# EAGLE design BBPS_SMD (EAGLE 6.2)
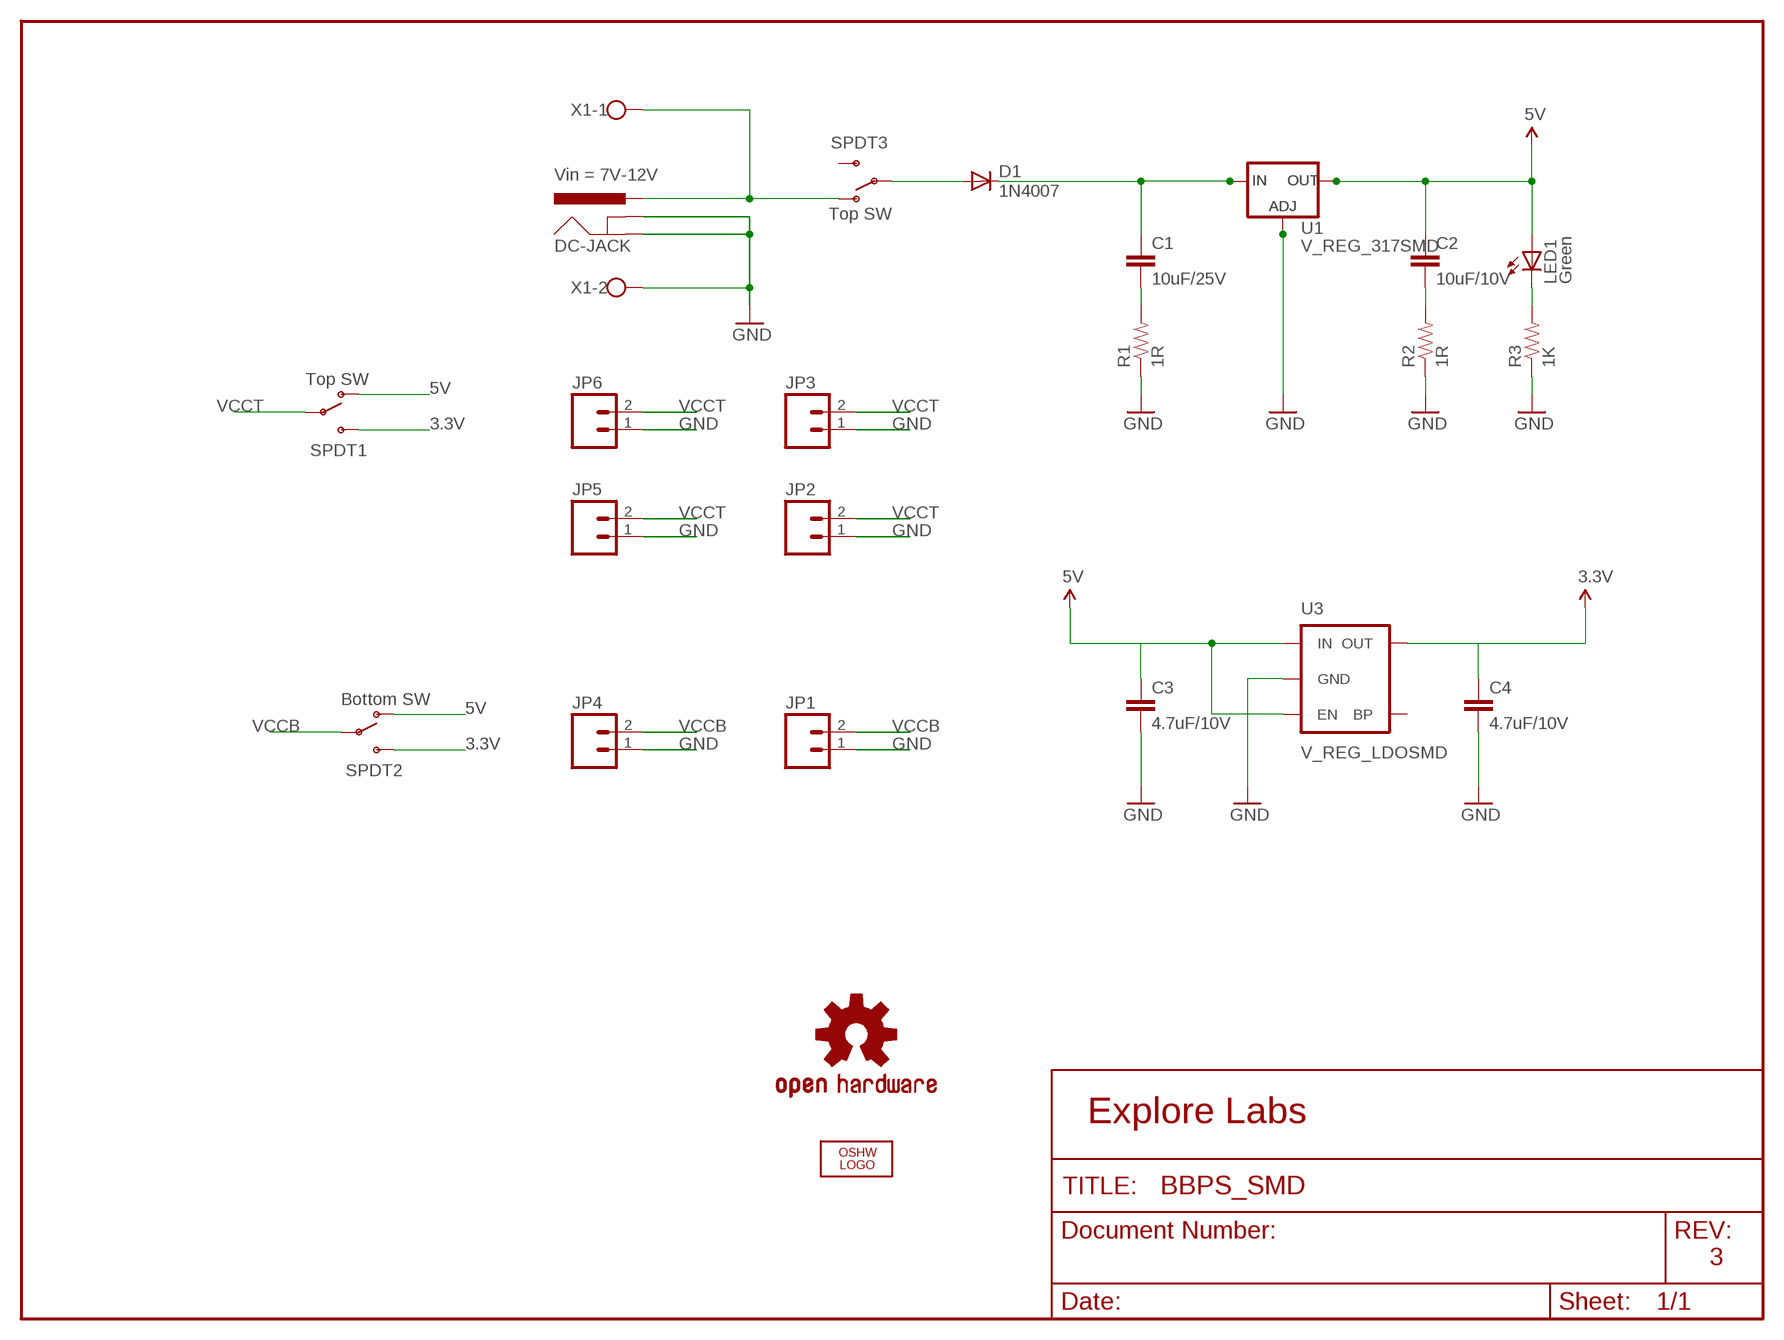
[diagram p0: schematic, sheet 1]

## Parts
C1  10uF/25V  CAP0603-CAP  [0603-CAP]
C2  10uF/10V  CAP0603-CAP  [0603-CAP]
C3  4.7uF/10V  CAP0603-CAP  [0603-CAP]
C4  4.7uF/10V  CAP0603-CAP  [0603-CAP]
D1  1N4007  DIODESMA-KIT  [SMA-DIODE-KIT]
DC-JACK  Vin = 7V-12V  POWER_JACKPTH  [POWER_JACK_PTH]
JP1  M02PTH  [1X02]
JP2  M02PTH  [1X02]
JP3  M02PTH  [1X02]
JP4  M02PTH  [1X02]
JP5  M02PTH  [1X02]
JP6  M02PTH  [1X02]
LED1  Green  LEDCHIPLED_0805  [CHIPLED_0805]
LOGO2  OSHW_LOGO_FILLX0100-NT  [OSHW_FILLX100_NOTEXT]
R1  1R  RESISTOR0603-RES  [0603-RES]
R2  1R  RESISTOR0603-RES  [0603-RES]
R3  1K  RESISTOR0603-RES  [0603-RES]
SPDT1  Top SW  SWITCH-SPSTPTH  [SWITCH-SPDT]
SPDT2  Bottom SW  SWITCH-SPSTPTH  [SWITCH-SPDT]
SPDT3  Top SW  SWITCH-SPSTPTH  [SWITCH-SPDT]
U1  V_REG_317SMD  [SOT223]
U2  V_REG_317DPACK  [V-REG_DPACK]
U3  V_REG_LDOSMD  [SOT23-5]
U$3  OSHW-LOGOM  [OSHW-LOGO-M]
X1  W237-102  [W237-102]

## Nets
3.3V: C4.1 SPDT1.3(S) SPDT2.3(S) U3.5(OUT)
5V: C2.1 C3.1 LED1.A SPDT1.1(O) SPDT2.1(O) U1.2(OUT) U2.4(OUT) U3.1(IN) U3.3(EN)
GND: C3.2 C4.2 DC-JACK.GND DC-JACK.GNDBREAK JP1.1 JP2.1 JP3.1 JP4.1 JP5.1 JP6.1 R1.1 R2.1 R3.1 U1.1(ADJ) U2.1(ADJ) U3.2(GND) X1.2
N$2: D1.A SPDT3.2(P)
N$5: DC-JACK.PWR SPDT3.1(O) X1.1
N$6: C1.2 R1.2
N$8: C2.2 R2.2
N$10: LED1.C R3.2
N$13: C1.1 D1.C U1.3(IN) U2.3(IN)
VCCB: JP1.2 JP4.2 SPDT2.2(P)
VCCT: JP2.2 JP3.2 JP5.2 JP6.2 SPDT1.2(P)
Unconnected: SPDT3.3(S) U3.4(BP)

## Notes on the sheet
- Explore Labs
- 3

## Library data of the parts
C1-C4 = SparkFun-Passives:CAP: Capacitor Standard 0603 ceramic capacitor, and 0.1" leaded capacitor.
D1 = SparkFun-DiscreteSemi:DIODE: Diode These are standard reverse protection diodes and small signal diodes. SMA package can handle up to about 1A. SOD-323 can handle about 200mA. What the SOD-323 package when ordering, there are some mfgs out there that are 5-pin packages.
DC-JACK = SparkFun:POWER_JACK: Power Jack This is the standard 5.5mm barrel jack for power. The PTH is the most common, proven, reliable, footprint. All others are experimental. The Slot footprint only works if the mill layer is transmitted to the PCB fab house so be warned. Spark Fun Electronics SKU : PRT-00119. Mating wall wart : TOL-00298 (and others)
JP1-JP6 = SparkFun-Connectors:M02: Header 2 Standard 2-pin 0.1" header. Use with straight break away headers (SKU : PRT-00116), right angle break away headers (PRT-00553), swiss pins (PRT-00743), machine pins (PRT-00117), and female headers (PRT-00115). Molex polarized connector foot print use with SKU : PRT-08233 with associated crimp pins and housings.
LED1 = led:LED: LED OSRAM: - CHIPLED LG R971, LG N971, LY N971, LG Q971, LY Q971, LO R971, LY R971 LH N974, LH R974 LS Q976, LO Q976, LY Q976 LO Q996 - Hyper CHIPLED LW Q18S LB Q993, LB Q99A, LB R99A - SideLED LS A670, LO A670, LY A670, LG A670, LP A670 LB A673, LV A673, LT A673, LW A673 LH A674 LY A675 LS A676, LA A676, LO A676, LY A676, LW A676 LS A679, LY A679, LG A679 - Hyper Micro SIDELED® LS Y876, LA Y876, LO Y876, LY Y876 LT Y87S - SmartLED LW L88C, LW L88S LB L89C, LB L89S, LG L890 LS L89K, LO L89K, LY L89K LS L896, LA L896, LO L896, LY L896 - TOPLED LS T670, LO T670, LY T670, LG T670, LP T670 LSG T670, LSP T670, LSY T670, LOP T670, LYG T670 LG T671, LOG T671, LSG T671 LB T673, LV T673, LT T673, LW T673 LH T674 LS T676, LA T676, LO T676, LY T676, LB T676, LH T676, LSB T676, LW T676 LB T67C, LV T67C, LT T67C, LS T67K, LO T67K, LY T67K, LW E67C LS E67B, LA E67B, LO E67B, LY E67B, LB E67C, LV E67C, LT E67C LW T67C LS T679, LY T679, LG T679 LS T770, LO T770, LY T770, LG T770, LP T770 LB T773, LV T773, LT T773, LW T773 LH T774 LS E675, LA E675, LY E675, LS T675 LS T776, LA T776, LO T776, LY T776, LB T776 LHGB T686 LT T68C, LB T68C - Hyper Mini TOPLED® LB M676 - Mini TOPLED Santana® LG M470 LS M47K, LO M47K, LY M47K Source: http://www.osram.convergy.de LUXEON: - LUMILED® LXK2-PW12-R00, LXK2-PW12-S00, LXK2-PW14-U00, LXK2-PW14-V00 LXK2-PM12-R00, LXK2-PM12-S00, LXK2-PM14-U00 LXK2-PE12-Q00, LXK2-PE12-R00, LXK2-PE12-S00, LXK2-PE14-T00, LXK2-PE14-U00 LXK2-PB12-K00, LXK2-PB12-L00, LXK2-PB12-M00, LXK2-PB14-N00, LXK2-PB14-P00, LXK2-PB14-Q00 LXK2-PR12-L00, LXK2-PR12-M00, LXK2-PR14-Q00, LXK2-PR14-R00 LXK2-PD12-Q00, LXK2-PD12-R00, LXK2-PD12-S00 LXK2-PH12-R00, LXK2-PH12-S00 LXK2-PL12-P00, LXK2-PL12-Q00, LXK2-PL12-R00 Source: www.luxeon.com KINGBRIGHT: KA-3528ASYC Source: www.kingbright.com
LOGO2 = ohw-logo:OSHW_LOGO_FILL
R1-R3 = SparkFun-Passives:RESISTOR: Resistor Basic schematic elements and footprints for 0603, 1206, and PTH resistors.
SPDT1-SPDT3 = SparkFun:SWITCH-SPST: SPST Switch Simple slide switch. Spark Fun Electronics SKU : COM-00102
U1 U2 = SparkFun-PowerIC:V_REG_317: Voltage Regulator Standard LM317 adjustable voltage regulator. AOI (Adjust Output Input). Google 'LM317 Calculator' for easy to use app to get the two resistor values needed. 240/720 for 5V output. 240/390 for 3.3V output. Spark Fun Electronics SKU : COM-00527
U3 = SparkFun-PowerIC:V_REG_LDO: Voltage Regulator LDO Standard 150mA LDO voltage regulator in SOT-23 layout. Micrel part MIC5205. BP (by-pass) pin is used to lower output noise with 470pF cap.
U$3 = SparkFun-Aesthetics:OSHW-LOGO: Open Source Hardware Logo This logo indicates the piece of hardware it is found on incorporates a OSHW license and/or adheres to the definition of open source hardware found here: http://freedomdefined.org/OSHW
X1 = con-wago-500:W237-102: WAGO SCREW CLAMP; MPN: 237-102; OC_FARNELL: unknown; OC_NEWARK: 70K9898

## Board
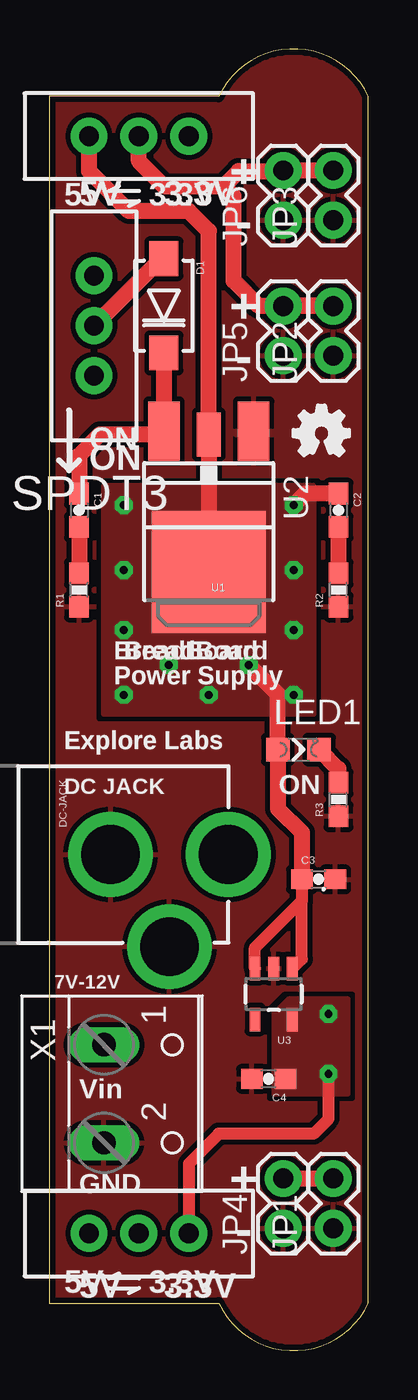
[diagram p1: board, top side]
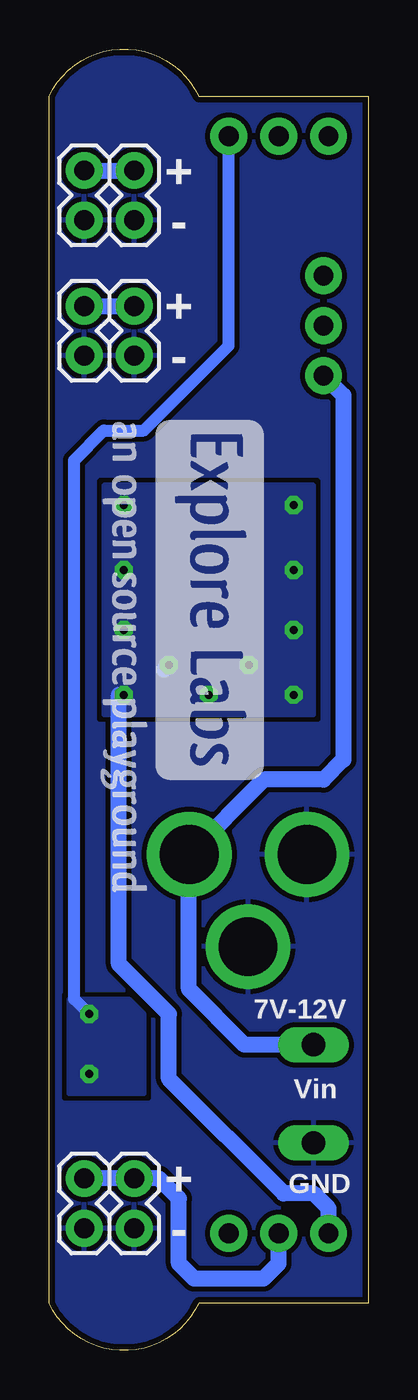
[diagram p2: board, bottom side, seen from below]

Size 16.26 x 66.27 mm. Coordinates in mm from the lower left corner, seen from the top.
Outline: 0,2.4 8.64,2.4 arc129 16.26,2.4 16.26,63.87 arc129 8.64,63.87 0,63.87 0,2.4
Copper layers (1*16): Top 0.035mm / dielectric 1.5mm / Bottom 0.035mm
Design rules: minimum track width 10mil, minimum drill 10mil, track to track 8mil, track to pad 8mil, pad to pad 8mil, via to via 8mil, smd to smd 8mil, copper to edge 12mil, drill to drill 8mil, minimum pad ring 12mil, minimum via ring 10mil, stop-mask expansion 4mil, vias tented up to drill 18mil, thermal gap 10mil
tRestrict: area 2.8,58.8 to 5.3,61.3; area 7.6,57.5 to 8.6,58.5
bRestrict: area 3,6.2 to 4.1,7.2

### Footprints (pad centres in the part's own frame; a part is rotated, then mirrored left to right if it is on the bottom)
0603-CAP = smd 1.1 x 1: 1 -0.85,0; 2 0.85,0
SMA-DIODE-KIT = smd 1.77 x 1.47: A -2.4,0; C 2.4,0
POWER_JACK_PTH = drill 2.997 pad 4.318: GND 0,7.7; GNDBREAK 4.7,10.7; PWR 0,13.7
1X02 = drill 1.016 pad 1.88: 1 0,0; 2 2.54,0
CHIPLED_0805 = smd 1.2 x 1.2: A 0,-1.05; C 0,1.05
0603-RES = smd 1.1 x 1: 1 -0.85,0; 2 0.85,0
SWITCH-SPDT = drill 1.016 pad 1.88: 1 0,2.54; 2 0,0; 3 0,-2.54
SOT223 = smd 1.219 x 2.235: 1 -2.311,-3.099; 2 0,-3.099; 3 2.311,-3.099 | smd 3.6 x 2.2: 4 0,3.099
V-REG_DPACK = smd 1.6 x 3: 1 -2.28,-4.8; 3 2.28,-4.8 | smd 5.8 x 6.2: 4 0,2.38
SOT23-5 = smd 0.55 x 1.2: 1 -0.95,-1.3; 2 0,-1.3; 3 0.95,-1.3; 4 0.95,1.3; 5 -0.95,1.3
W237-102 = drill 1.194 long: 1 -2.5,-1.27; 2 2.5,-1.27

### Placement (x,y rotation side)
C1  1.52,42.79 270 top
C2  14.73,42.79 270 top
C3  13.72,23.99 0 top
C4  11.18,13.83 180 top
D1  5.84,53.2 270 top
DC-JACK  -4.57,25.26 270 top
JP1  14.47,6.21 90 top
JP2  14.47,50.65 90 top
JP3  14.47,57.55 90 top
JP4  11.93,6.21 90 top
JP5  11.93,50.65 90 top
JP6  11.93,57.55 90 top
LED1  12.7,30.6 270 top
LOGO2  12.45,45.58 0 top
R1  1.52,38.72 90 top
R2  14.73,38.72 90 top
R3  14.73,28.06 90 top
SPDT1  4.57,61.84 90 top
SPDT2  4.57,5.96 90 top
SPDT3  2.29,52.19 180 top
U1  8.13,43.55 180 top
U2  8.13,42.03 180 top
U3  11.43,18.15 180 top
U$3  24.38,45.07 0 bottom  (outside the outline)
U$5  [EXLABS_LOGO_0.5]  15.24,48.12 270 bottom
X1  4.06,13.07 270 top

### Tracks (layer width: path | path; a pad name or v marks a point on that pad's centre or on a via)
3.3V  (via drill 0.41)
  Top 0.61: v14.22,14.09 14.22,11.8 13.46,11.04 8.64,11.04 7.11,9.51 SPDT2.3
  Bottom 0.61: v14.22,17.13 14.99,17.9 14.99,45.33 13.46,46.85 11.43,46.85 7.11,51.17 SPDT1.3
  pour Bottom (isolate 0.305, rank 3, no thermals): 11.43,17.13 11.43,13.07 15.24,13.07 15.24,17.9 12.19,17.9
  pour Top (isolate 0.305, rank 3, no thermals): 11.43,17.13 11.43,13.07 15.24,13.07 15.24,17.9 12.19,17.9
5V  (via drill 0.41)
  Top 0.61: U3.1 12.87,19.94 12.87,22.89 | U3.3 10.48,20.5 12.87,22.89 | C3.1 12.87,22.89
  Top 0.813: U2.4 U1.2 8.13,57.01 7.11,58.03 4.06,58.03 2.03,60.06 SPDT1.1 | 11.34,33.73 v10.16,34.91 11.65,33.42 LED1.A 11.65,27.58 12.87,26.37 C3.1 | C2.1 13.04,43.64 v12.45,43.04
  Bottom 0.813: 10.41,34.66 v10.16,34.91 | SPDT2.1 2.03,7.23 2.79,7.99 4.32,7.99 10.16,13.83 10.16,17.13 12.7,19.67 12.7,33.39 v12.45,33.39
  other vias: 12.45,39.74 3.81,39.74 3.81,43.04 3.81,36.69 3.81,33.39 6.1,34.91 12.45,36.69 8.13,33.39
  pour Bottom (isolate 0.305): 2.79,44.06 13.46,44.06 13.46,32.37 2.79,32.37
  pour Top (isolate 0.305, rank 2, no thermals): 2.79,44.06 13.46,44.06 13.46,32.37 2.79,32.37
GND
  pour Bottom (isolate 0.254, rank 6): 0,63.87 8.64,63.87 arc-124 16.26,63.87 16.26,2.4 arc-124 8.64,2.4 0,2.4
  pour Top (isolate 0.254, rank 6): 0,63.87 8.64,63.87 arc-124 16.26,63.87 16.26,2.4 arc-129 8.64,2.4 0,2.4
N$2
  Top 0.813: D1.A 5.7,55.6 SPDT3.2
N$5
  Bottom 0.813: X1.1 6.31,15.57 9.14,18.4 9.14,25.25 DC-JACK.PWR 5.32,29.07 2.29,29.07 1.27,30.09 1.27,48.63 SPDT3.1
N$6
  Top 0.813: C1.2 R1.2
N$8
  Top 0.813: C2.2 R2.2
N$10
  Top 0.813: LED1.C 14.73,29.61 R3.2
N$13
  Top 0.813: D1.C U2.3 | U2.3 | C1.1 1.52,45.58 2.59,46.65 U1.3 5.84,46.67 U2.3
VCCB
  Top 0.813: JP4.2 JP1.2
  Bottom 0.813: JP1.2 JP4.2 10.67,8.75 9.65,7.74 9.65,4.43 8.89,3.67 5.33,3.67 4.57,4.43 SPDT2.2
VCCT
  Top 0.813: JP5.2 arc-2 JP2.2 10.68,53.19 9.4,54.47 9.4,58.79 8.89,59.3 | JP3.2 JP6.2 11.9,60.06 9.65,60.06 8.89,59.3 | 8.89,59.3 5.84,59.3 4.57,60.57 SPDT1.2
  Bottom 0.813: JP2.2 JP5.2 | JP3.2 JP6.2

### Text on the board
tNames: 5V | 3.3V | ON | BreadBoard | Power Supply | Explore Labs | 5V | 3.3V
tDocu: 51.34mm from bottom rail's origin | 44.44mm from bottom rail's origin
_tsilk: + | 5V | 3.3V | - | + | - | ON | BreadBoard | Power Supply | Explore Labs | DC JACK | ON | 7V-12V | Vin | GND | + | - | 5V | 3.3V
_bsilk: + | - | + | - | 7V-12V | Vin | GND | + | -